# Altium schematic sheet Block Diagram.SchDoc
size Tabloid; DrawnBy: Krutav Shah; SheetNumber: 3; SheetTotal: 3
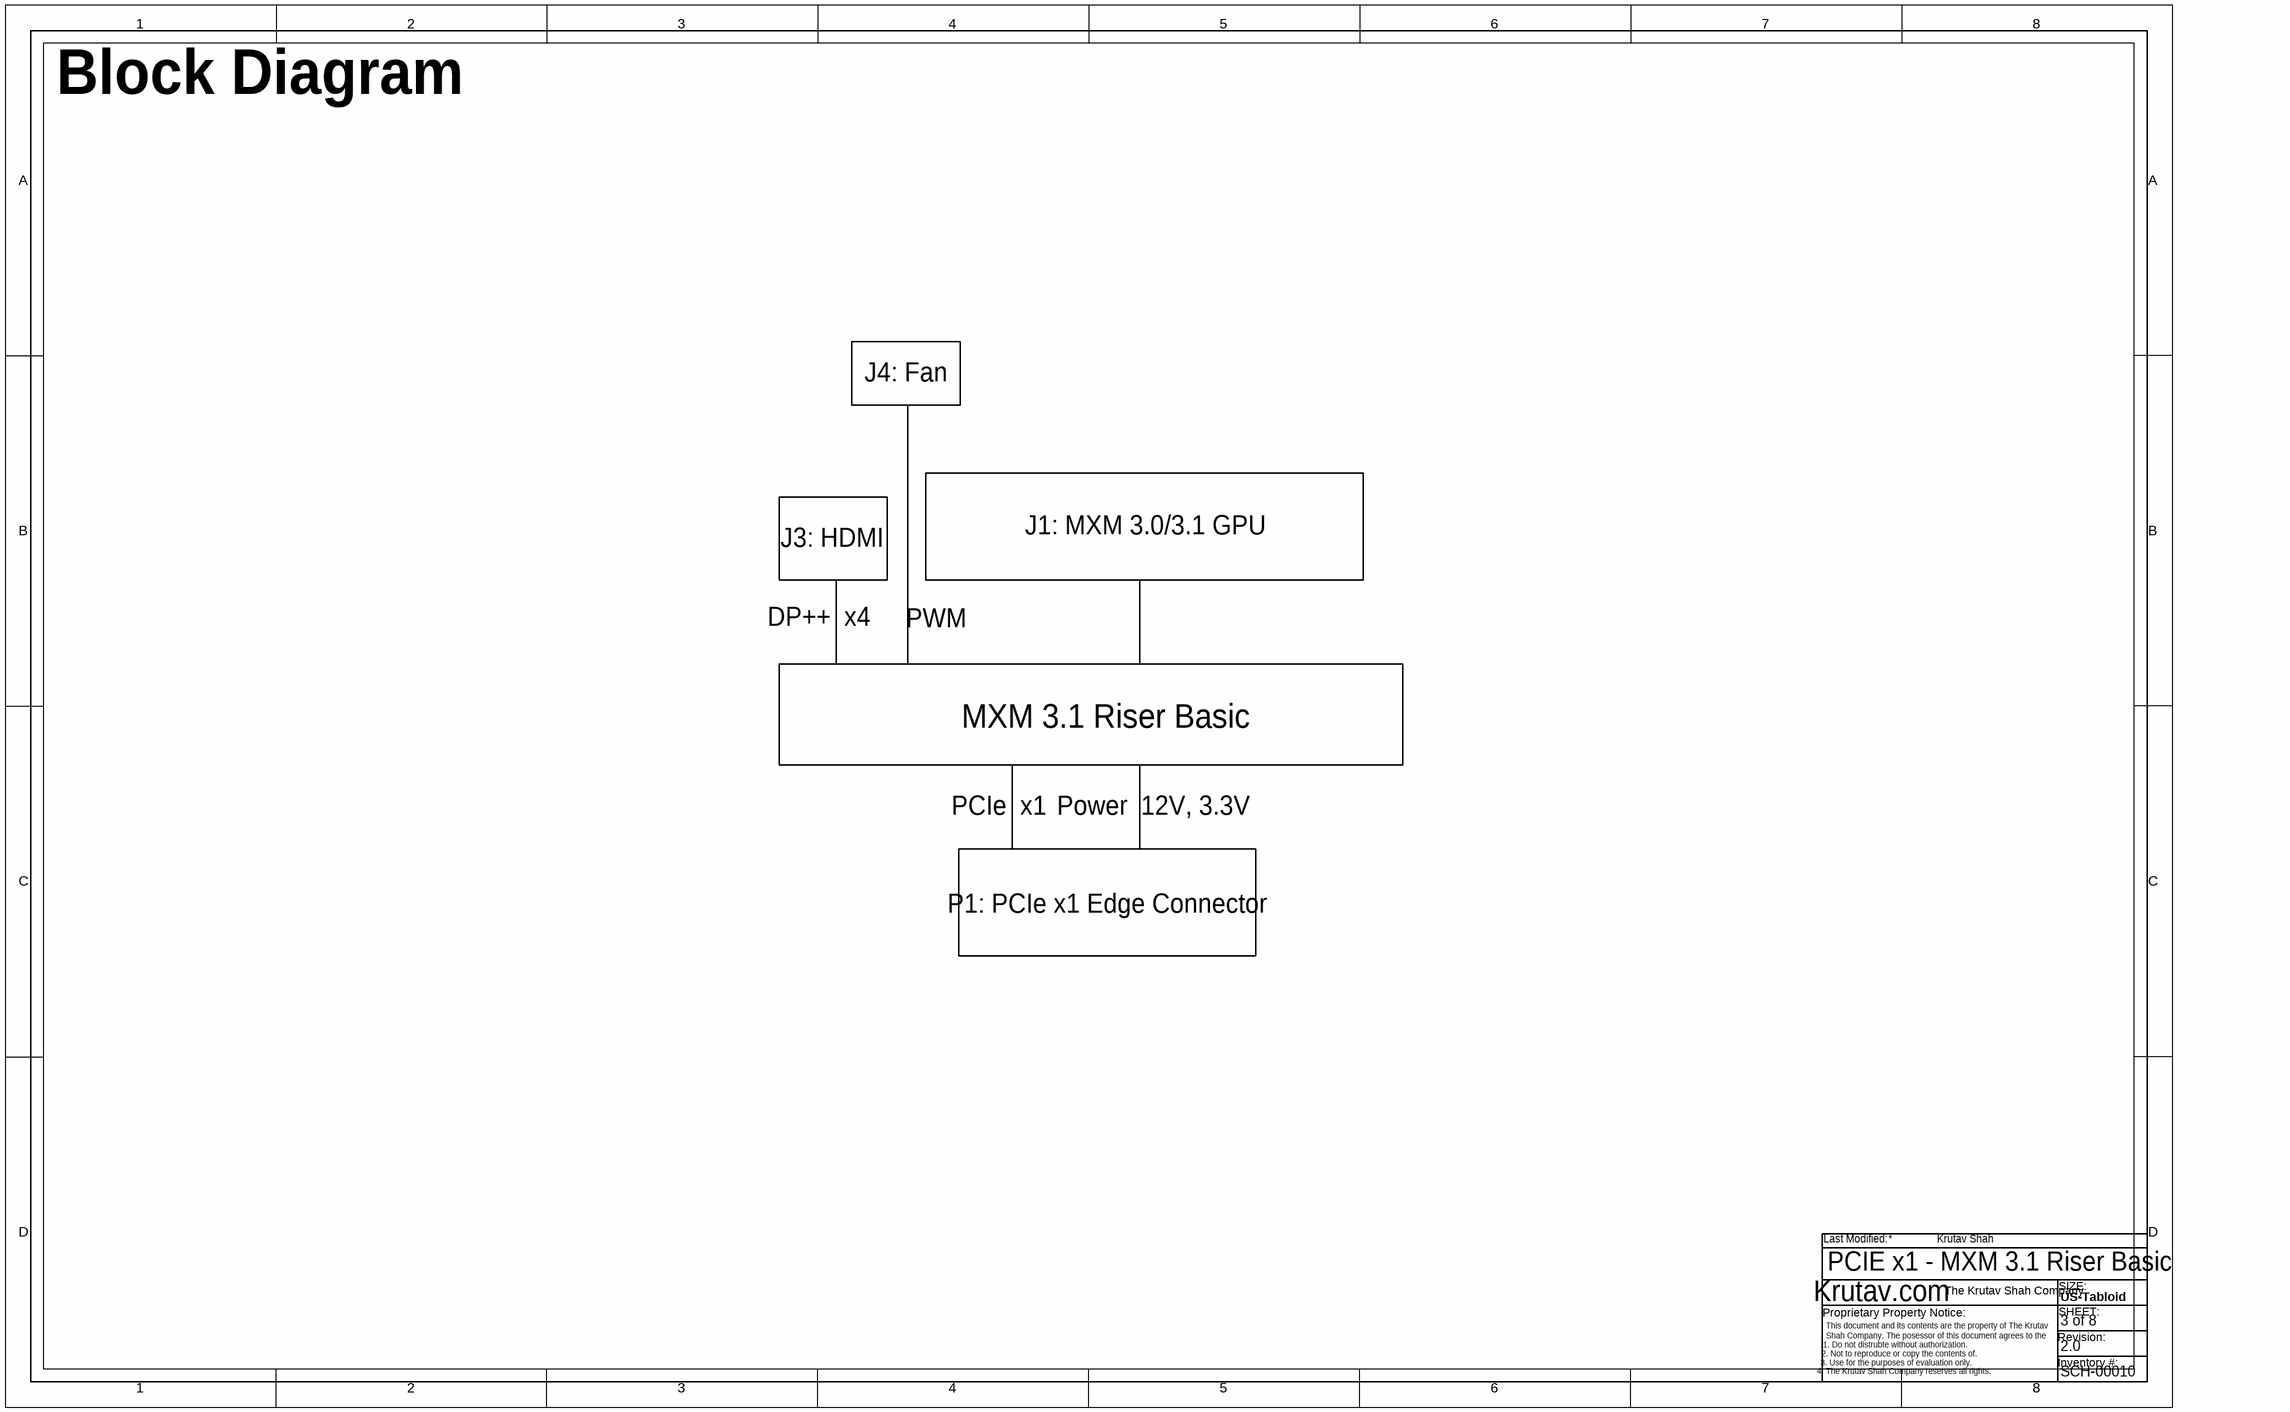
[diagram p0: Block Diagram.SchDoc]

## Notes on the sheet
- Block Diagram
- J4: Fan
- J3: HDMI
- J1: MXM 3.0/3.1 GPU
- DP++  x4
- PWM
- MXM 3.1 Riser Basic
- PCIe  x1
- Power  12V, 3.3V
- P1: PCIe x1 Edge Connector
- PCIE x1 - MXM 3.1 Riser Basic
- 3 of 8
- 2.0
- SCH-00010
- Last Modified:
- Krutav.com
- The Krutav Shah Company
- US-Tabloid
- SIZE:
- SHEET:
- This document and its contents are the property of The Krutav Shah Company. The posessor of this document agrees to the following:
- Proprietary Property Notice:
- 1. Do not distrubte without authorization.
- 3. Use for the purposes of evaluation only.
- 2. Not to reproduce or copy the contents of.
- 4. The Krutav Shah Company reserves all rights.
- Revision:
- Inventory #: